# EAGLE design AC_zadnja (EAGLE 7.3.0)
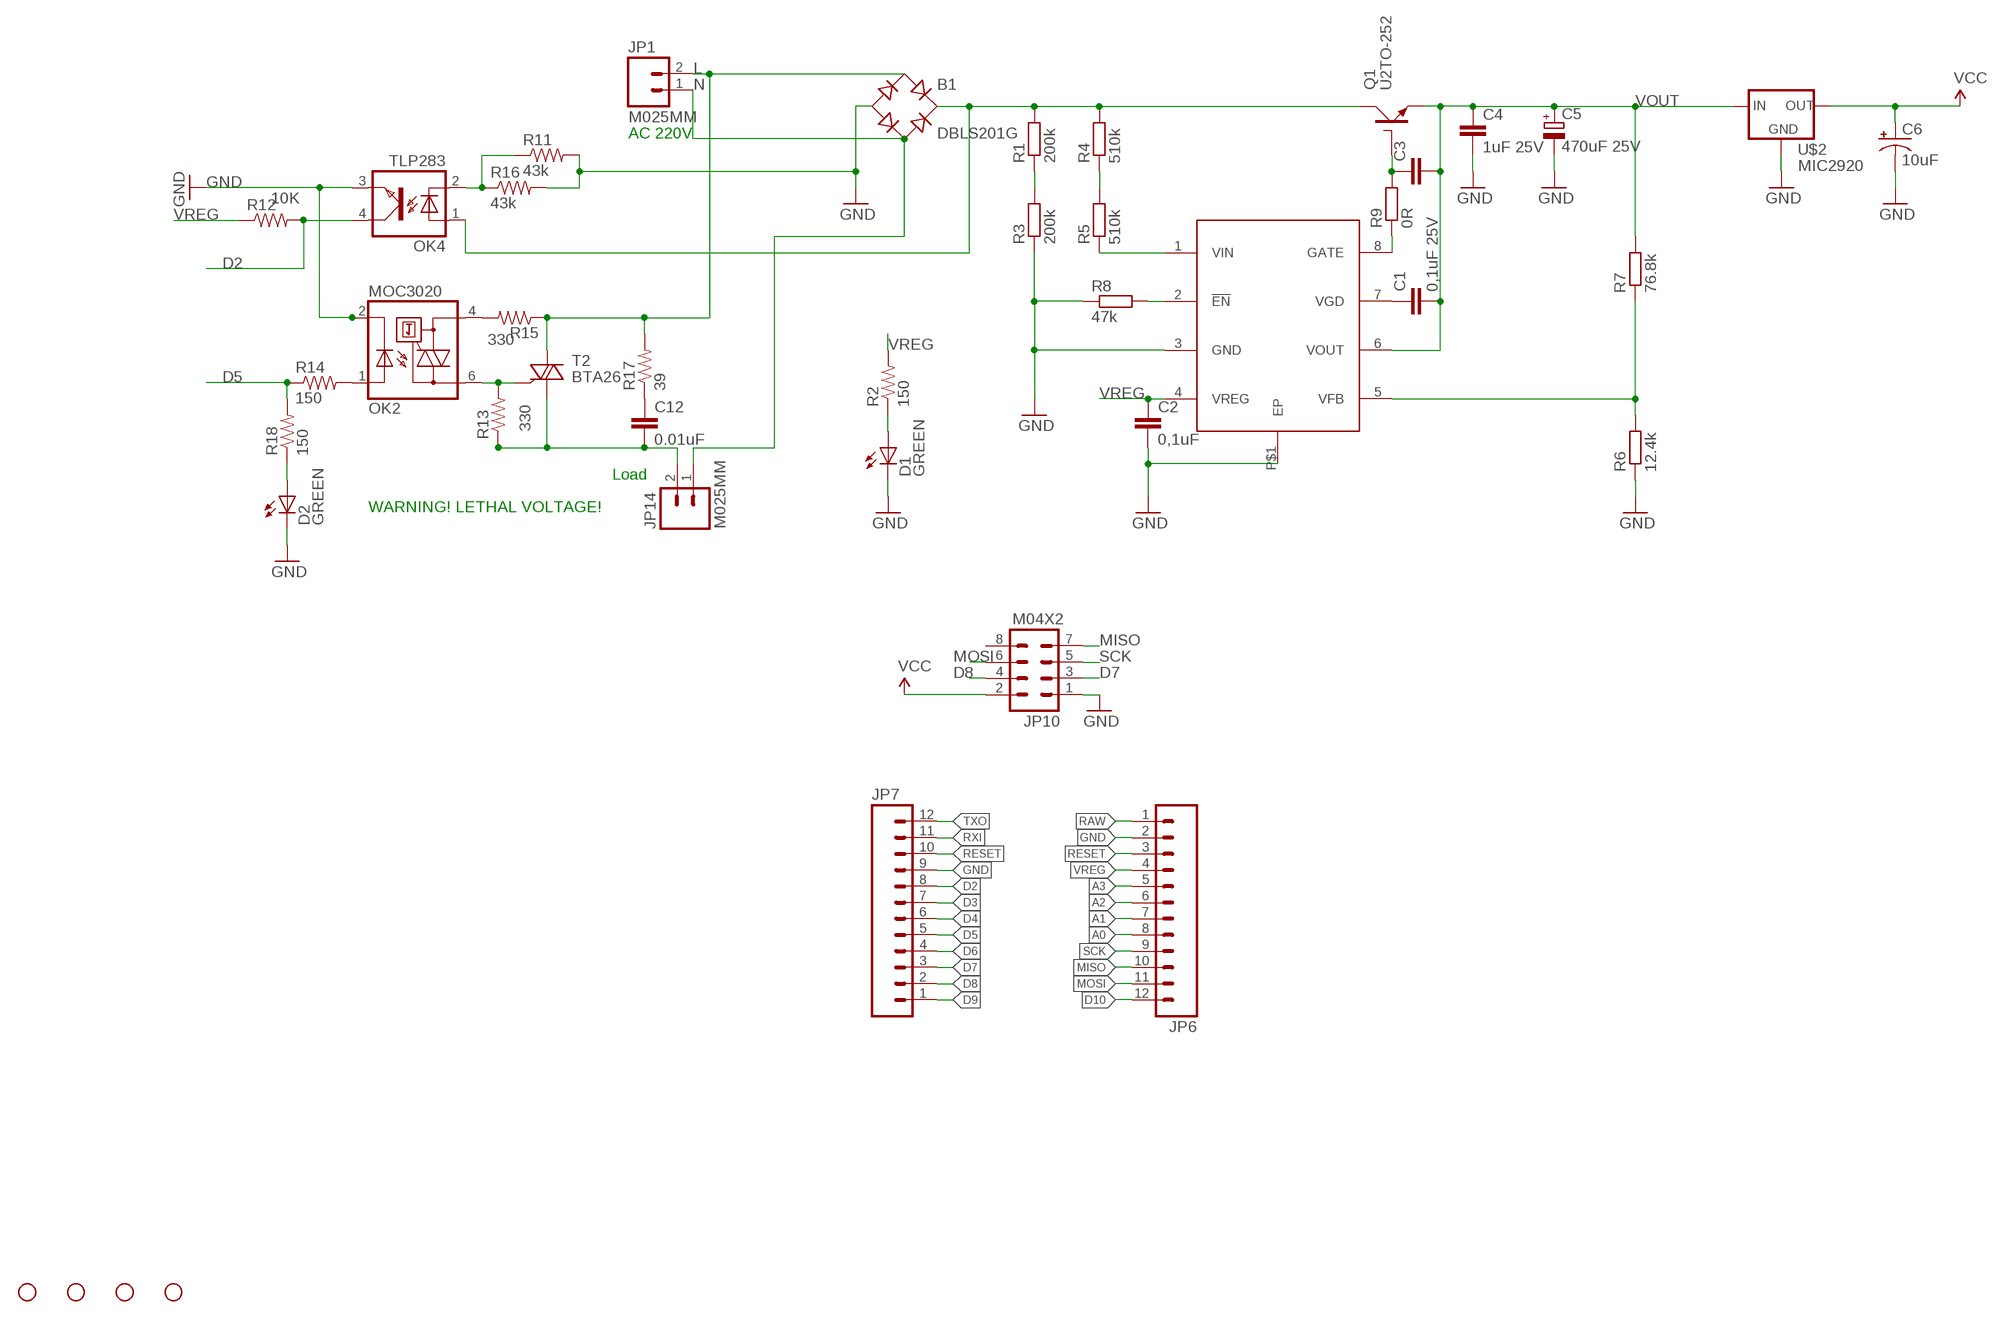
[diagram p0: schematic, sheet 1]

## Parts
B1  DBLS201G  [DBS]
C1  0,1uF 25V  C-EUC0805  [C0805]
C2  0,1uF  C-EUC0805  [C0805]
C3  C-EUC0805  [C0805]
C4  1uF 25V  C-EUC1206  [C1206]
C5  470uF 25V  CPOL-EU153CLV-1010  [153CLV-1010]
C6  10uF  10UF-TANT  [EIA3216]
C12  0.01uF  C-EUC1206  [C1206]
D1  GREEN  LG_T679-E1F1-1  [PLCC2]
D2  GREEN  LG_T679-E1F1-1  [PLCC2]
JP1  M025MM  [SCREWTERMINAL-5MM-2]
JP6  M12PTH  [1X12]
JP7  M12PTH  [1X12]
JP10  M04X2  [2X4]
JP14  M025MM  [SCREWTERMINAL-5MM-2]
OK2  MOC3020  MOC3031S  [DIL6-SMD]
OK4  TLP283  [MINI-FLAT-4]
Q1  U2TO-252  [D-PAK_TO252AA]
R1  200k  R-EU_M1206  [M1206]
R2  150  RESISTOR0805-RES  [0805]
R3  200k  R-EU_M1206  [M1206]
R4  510k  R-EU_M1206  [M1206]
R5  510k  R-EU_M1206  [M1206]
R6  12.4k  R-EU_M0805  [M0805]
R7  76.8k  R-EU_M0805  [M0805]
R8  47k  R-EU_M0805  [M0805]
R9  0R  R-EU_M0805  [M0805]
R11  43k  RESISTOR1206  [1206]
R12  RESISTOR0805-RES  [0805]
R13  RESISTOR1206  [1206]
R14  150  RESISTOR0805-RES  [0805]
R15  RESISTOR1206  [1206]
R16  43k  RESISTOR1206  [1206]
R17  39  RESISTOR1206  [1206]
R18  150  RESISTOR0805-RES  [0805]
STANDOFF1  STAND-OFFTIGHT  [STAND-OFF-TIGHT]
STANDOFF2  STAND-OFFTIGHT  [STAND-OFF-TIGHT]
STANDOFF3  STAND-OFFTIGHT  [STAND-OFF-TIGHT]
STANDOFF4  STAND-OFFTIGHT  [STAND-OFF-TIGHT]
T2  BTA26  BTA26D2PAK  [DPACK_2]
U$1  U1  [SOIC08]
U$2  MIC2920  V_REG_MIC2920  [SOT223]

## Nets
A0: JP6.8
A1: JP6.7
A2: JP6.6
A3: JP6.5
D2: JP7.8 OK4.4(COL) R12.2
D3: JP7.7
D4: JP7.6
D5: JP7.5 R14.1 R18.2
D6: JP7.4
D7: JP7.3 JP10.3
D8: JP7.2 JP10.4
D9: JP7.1
D10: JP6.12
GND: B1.- C2.2 C4.2 C5.- C6.C(-) D1.C D2.C JP6.2 JP7.9 JP10.1 OK2.2(C) OK4.3(EMIT) R3.1 R6.1 R8.1 R11.2 R16.2 U$1.3(GND) U$1.P$1(EP) U$2.2(GND)
L: B1.AC1 JP1.2 R15.1 R17.2 T2.D(A2)
MISO: JP6.10 JP10.7
MOSI: JP6.11 JP10.6
N: B1.AC2 JP1.1 JP14.1
N$1: D1.A R2.1
N$4: R1.1 R3.2
N$5: R4.1 R5.2
N$6: R5.1 U$1.1(VIN)
N$7: C3.1 Q1.1(G) R9.2
N$8: R9.1 U$1.8(GATE)
N$9: R8.2 U$1.2(!EN)
N$11: C1.1 U$1.7(VGD)
N$13: R6.2 R7.1 U$1.5(VFB)
N$15: B1.+ OK4.1(A) Q1.4(C) R1.2 R4.2
N$17: OK4.2(C) R11.1 R16.1
N$28: C12.2 JP14.2 R13.1 T2.G(A1)
N$29: OK2.6(A2) R13.2 T2.S(G)
N$31: OK2.4(A1) R15.2
N$33: OK2.1(A) R14.2
N$37: C12.1 R17.1
N$38: D2.A R18.1
RAW [vcc]: JP6.1
RESET: JP6.3 JP7.10
RXI: JP7.11
SCK: JP6.9 JP10.5
TXO: JP7.12
VCC: C6.A(+) JP10.2 U$2.3(OUT)
VOUT: C1.2 C3.2 C4.1 C5.+ Q1.3(E) R7.2 U$1.6(VOUT) U$2.1(IN)
VREG: C2.1 JP6.4 R2.2 R12.1 U$1.4(VREG)
Unconnected: JP10.8

## Notes on the sheet
- AC 220V
- Load
- WARNING! LETHAL VOLTAGE!

## Library data of the parts
B1 = rectifier:DB?*G: Single Phase 1.0 AMP Glass Passivated Bridge Rectifier Taiwan Semiconductor Co.,Ltd. - TSC Source: http://www.taiwansemi.com/TSCbig5/ezcatfiles/cust/img/img/db101g.pdf http://www.ts.com.tw/db/pictures/modules/PDT/PDT060207001/DBLS201G.pdf
C1-C4 = resistor:C-EU: CAPACITOR, European symbol
C5 = resistor:CPOL-EU: POLARIZED CAPACITOR, European symbol
C6 = SparkFun-Retired:10UF-TANT: 10uF Tantalum SMT CAP-00811- 16V 10% (EIA-3216); PROD_ID: CAP-00811
C12 = rcl:C-EU: CAPACITOR, European symbol
D1 D2 = led:*_T679-?-1: LC TOPLED® Low Current LED Source: http://catalog.osram-os.com .. LG_LS_LY_T679_OBS.pdf; COLOR: green
JP1 JP14 = SparkFun-Connectors:M02: Standard 2-pin 0.1" header. Use with - straight break away headers ( PRT-00116) - right angle break away headers (PRT-00553) - swiss pins (PRT-00743) - machine pins (PRT-00117) - female headers (PRT-00115) Molex polarized connector foot print use with: PRT-08233 with associated crimp pins and housings. 2.54_SCREWTERM for use with PRT-10571. 3.5mm Screw Terminal footprints for PRT-08084 5mm Screw Terminal footprints for use with PRT-08432; STOREFRONT_ID: PRT-08432
JP6 JP7 = SparkFun:M12: Header 12 Standard 12-pin 0.1" header. Use with straight break away headers (SKU : PRT-00116), right angle break away headers (PRT-00553), swiss pins (PRT-00743), machine pins (PRT-00117), and female headers (PRT-00115).
JP10 = SparkFun-Connectors:M04X2: .1" header, two rows of four.
OK2 = optocoupler:MOC30*: 6-Pin DIP Zero-Cross Optoisolators Triac Driver Output (250/400 Volt Peak) Source: Data sheet <http://www.fairchildsemi.com/ds/MO/MOC3031M.pdf> The old path of data sheet not more available 2013-05-06.; MF: FAIRCHILD SEMICONDUCTOR; MPN: MOC3031SM; OC_FARNELL: unknown; OC_NEWARK: 34C1335
OK4 = optocoupler:TLP283: TOSHIBA PHOTOCOUPLER GaAs IRED & PHOTO-TRANSISTOR Source: http://www.semicon.toshiba.co.jp/td/en/Opto/Photocoupler/en_20050928_TLP283_datasheet.pdf; OC_FARNELL: unknown; OC_NEWARK: unknown
Q1 = Moja Knjižnica:U2
R1 R3-R9 = resistor:R-EU_: RESISTOR, European symbol
R2 R13-R15 R18 = SparkFun-Resistors:RESISTOR: Resistor Basic schematic elements and footprints for 0603, 1206, and PTH resistors.; OHM: 330
R11 R16 R17 = SparkFun-Resistors:RESISTOR: Resistor Basic schematic elements and footprints for 0603, 1206, and PTH resistors.; K: 45K
R12 = SparkFun-Resistors:RESISTOR: Resistor Basic schematic elements and footprints for 0603, 1206, and PTH resistors.; OHM: 10K
STANDOFF1-STANDOFF4 = SparkFun-Electromechanical:STAND-OFF: #4 Stand Off This is the mechanical footprint for a #4 phillips button head screw. Use the keepout ring to avoid running the screw head into surrounding components. SKU : PRT-00447
T2 = triac:BTA26: 25A TRIAC Source: http://www.st.com/stonline/products/literature/ds/7470.pdf
U$1 = Moja Knjižnica:U1
U$2 = SparkFun-PowerIC:V_REG_MIC2920: MIC2920A (http://www.micrel.com/_PDF/mic2920.pdf) - 400mA output LDO Regulator

## Net classes
1 vcc: width 0.254 mm

## Board
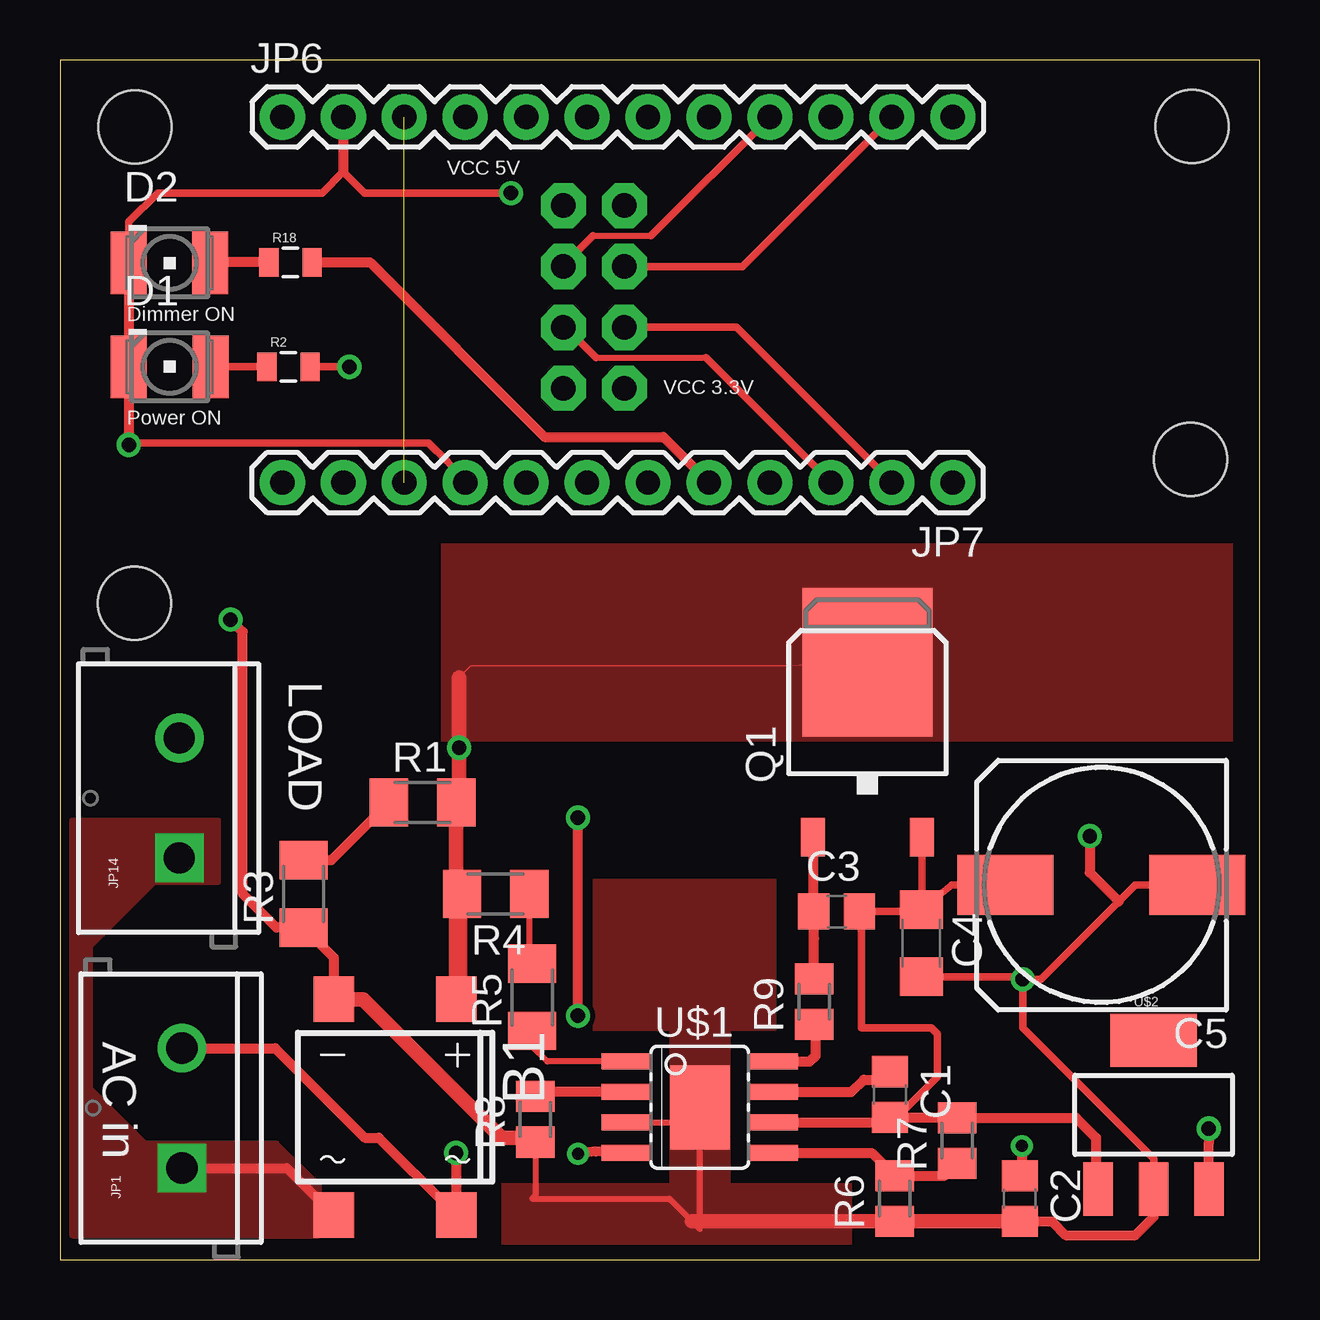
[diagram p1: board, top side]
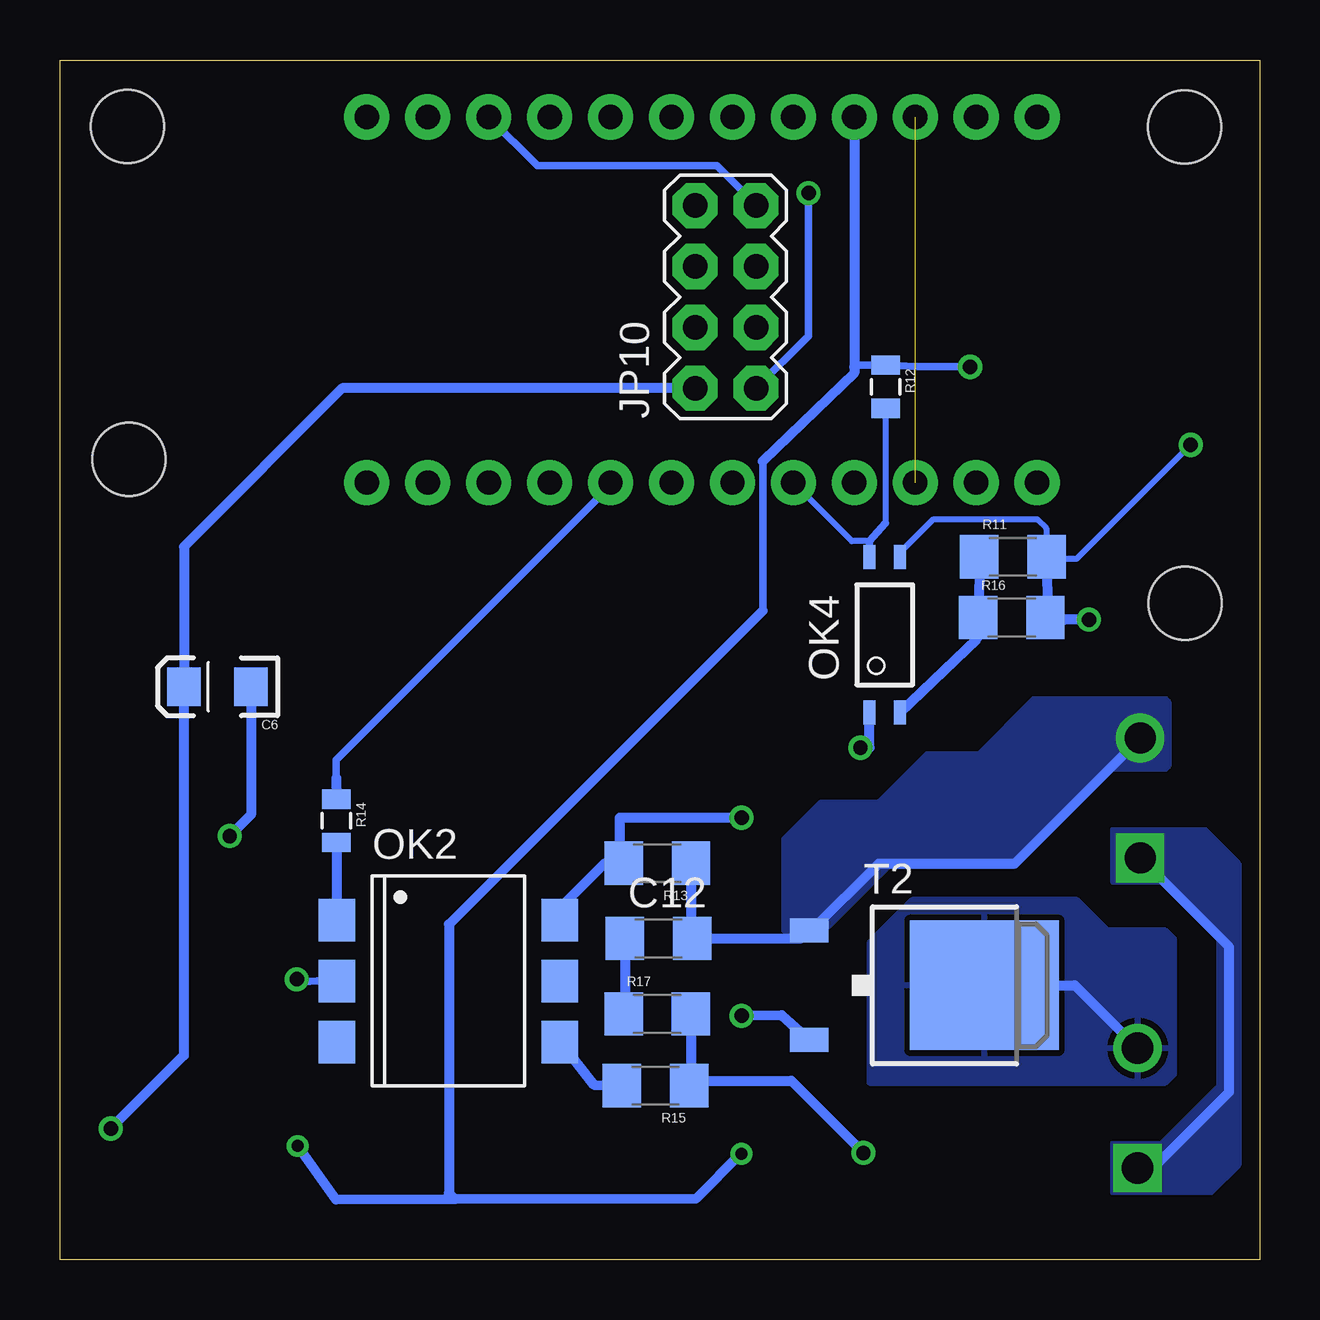
[diagram p2: board, bottom side, seen from below]

Size 50 x 50 mm. Coordinates in mm from the lower left corner, seen from the top.
Outline: 0,0 50,0 50,50 0,50 0,0
Copper layers (1*16): Top 0.035mm / dielectric 1.5mm / Bottom 0.035mm
Design rules "default *": minimum track width 10mil, minimum drill 24mil, track to track 8mil, track to pad 8mil, pad to pad 8mil, via to via 8mil, smd to smd 8mil, copper to edge 10mil, drill to drill 8mil, minimum pad ring 10mil, minimum via ring 8mil, stop-mask expansion 4mil, vias tented up to drill 0mil, thermal gap 10mil

### Footprints (pad centres in the part's own frame; a part is rotated, then mirrored left to right if it is on the bottom)
DBS = smd 1.7 x 1.9: + -2.55,-4.5; - 2.55,-4.5; AC1 -2.55,4.5; AC2 2.55,4.5
C0805 = smd 1.3 x 1.5: 1 -0.95,0; 2 0.95,0
C1206 = smd 1.6 x 1.8: 1 -1.4,0; 2 1.4,0
153CLV-1010 = smd 4 x 2.5: + 4,0; - -4,0
EIA3216 = smd 1.4 x 1.6: A 1.4,0; C -1.4,0
PLCC2 = smd 2.6 x 1.5: A 0,1.7; C 0,-1.7
SCREWTERMINAL-5MM-2 = drill 1.3 pad 2.032 square: 1 0,0 | drill 1.3 pad 2.032: 2 5,0
1X12 = drill 1.016 pad 1.88: 1 0,0; 2 2.54,0; 3 5.08,0; 4 7.62,0; 5 10.16,0; 6 12.7,0; 7 15.24,0; 8 17.78,0; 9 20.32,0; 10 22.86,0; 11 25.4,0; 12 27.94,0
2X4 = drill 1.016 pad 1.88 octagon: 1 -3.81,-1.27; 2 -3.81,1.27; 3 -1.27,-1.27; 4 -1.27,1.27; 5 1.27,-1.27; 6 1.27,1.27; 7 3.81,-1.27; 8 3.81,1.27
DIL6-SMD = smd 1.78 x 1.52: 1 -2.54,-4.645; 2 0,-4.645; 3 2.54,-4.645; 4 2.54,4.645; 5 0,4.645; 6 -2.54,4.645
MINI-FLAT-4 = smd 1 x 0.5: 1 -3.24,0.635; 2 -3.24,-0.635; 3 3.24,-0.635; 4 3.24,0.635
D-PAK_TO252AA = smd 1 x 1.6: 1 -2.28,-4.8; 3 2.28,-4.8 | smd 5.4 x 6.2: 4 0,2.5
M1206 = smd 1.6 x 2: 1 -1.4,0; 2 1.4,0
0805 = smd 0.8 x 1.2: 1 -0.9,0; 2 0.9,0
M0805 = smd 1.3 x 1.6: 1 -0.95,0; 2 0.95,0
1206 = smd 1.6 x 1.8: 1 -1.4,0; 2 1.4,0
STAND-OFF-TIGHT = hole 3.048: 0,0
DPACK_2 = smd 5.4 x 6.2: D 0,2.5 | smd 1 x 1.6: G -2.28,-4.8; S 2.28,-4.8
SOIC08 = smd 0.66 x 2.032: 1 -1.905,-3.073; 2 -0.635,-3.073; 3 0.635,-3.073; 4 1.905,-3.073; 5 1.905,3.073; 6 0.635,3.073; 7 -0.635,3.073; 8 -1.905,3.073 | smd 3.5 x 2.5: P$1 0,0
SOT223 = smd 1.219 x 2.235: 1 -2.311,-3.099; 2 0,-3.099; 3 2.311,-3.099 | smd 3.6 x 2.2: 4 0,3.099

### Placement (x,y rotation side)
B1  13.97,6.35 180 top
C1  34.59,6.88 270 top
C2  40.01,2.54 270 top
C3  32.37,14.5 0 top
C4  35.9,13.19 270 top
C5  43.41,15.61 180 top
C6  43.43,23.88 180 bottom
C12  25.05,13.39 0 bottom
D1  4.57,37.21 270 top
D2  4.57,41.54 270 top
JP1  5.08,3.81 90 top
JP6  9.27,47.62 0 top
JP7  37.21,32.38 180 top
JP10  22.26,40.12 90 bottom
JP14  4.97,16.73 90 top
OK2  33.81,11.61 270 bottom
OK4  15.62,26.04 90 bottom
Q1  33.66,22.4 0 top
R1  15.11,19.05 0 top
R2  9.53,37.21 0 top
R3  10.16,15.24 90 top
R4  18.16,15.24 180 top
R5  19.68,10.93 90 top
R6  34.79,2.54 90 top
R7  37.4,4.96 90 top
R8  19.82,5.85 90 top
R9  31.43,10.75 90 top
R11  10.28,29.3 0 bottom
R12  15.59,36.38 270 bottom
R13  25.1,16.52 180 bottom
R14  38.48,18.28 270 bottom
R15  25.18,7.25 180 bottom
R16  10.33,26.75 0 bottom
R17  25.11,10.24 0 bottom
R18  9.61,41.56 0 top
STANDOFF1  47.12,33.36 90 top
STANDOFF2  3.13,47.2 90 top
STANDOFF3  3.1,27.36 90 top
STANDOFF4  47.19,47.23 90 top
T2  13.97,11.43 270 bottom
U$1  26.67,6.35 270 top
U$2  45.59,6.04 0 top

### Tracks (layer width: path | path; a pad name or v marks a point on that pad's centre or on a via)
D2
  Bottom 0.254: R12.2 15.59,30.71 | 16.26,29.95 16.99,29.95 JP7.8
  Bottom 0.305: 15.59,30.71 16.26,29.95 OK4.4
D5
  Top 0.406: R18.2 12.92,41.56 20.19,34.29 25.15,34.29 JP7.5
  Bottom 0.305: JP7.5 27.05,32.26 38.48,20.83 38.48,20.07
  Bottom 0.406: 38.48,20.07 R14.1
D7
  Top 0.254: 22.35,37.59 26.92,37.59
  Top 0.305: JP10.3 21.09,38.85 22.35,37.59 | 26.92,37.59 JP7.3
D8
  Top 0.305: JP10.4 28.2,38.85 JP7.2
GND  (via drill 0.6)
  Top 0.254: R8.1 19.82,2.67 19.68,2.54 25.4,2.54 26.35,1.59 26.67,1.27 26.67,5.71 U$1.3
  Top 0.305: D1.C 2.87,37.59 | C5.- 44.81,15.61 44.13,14.92 40.89,11.68 v40.13,11.68 | C4.2 40.03,11.79 v40.13,11.68 | U$2.2 45.59,4.2 40.13,9.65 v40.13,11.68 | JP7.9 16.13,33.27 15.37,34.04 2.95,34.04 v2.87,33.96 | D2.C 2.87,43.26 4.06,44.45 10.92,44.45 11.81,45.34 12.7,44.45 v18.8,44.45
  Top 0.406: B1.- 11.42,12.58 R3.1 9.02,13.84 7.62,15.24 7.62,26.16 v7.11,26.67 | 45.72,2.8 U$2.2 45.59,2.93 45.59,1.78 44.83,1.02 41.91,1.02 41.34,1.59 C2.2 | D2.C 2.87,37.59 v2.87,33.96 | JP6.2 11.81,45.34 | v42.93,17.65 42.93,16.13 44.13,14.92
  Top 0.61: B1.- 12.64,10.85 18.41,5.08 19.64,5.08 R8.1 | C2.2 R6.1 26.36,1.59 26.35,1.59
  Bottom 0.254: OK4.3 14.99,29.46 13.59,30.86 9.27,30.86 8.89,30.48 R11.2 | 8.76,26.87 8.76,29.21 7.62,29.21 v2.87,33.96
  Bottom 0.305: v40.13,11.68 40.13,11.56 39.29,11.61 OK2.2 | 8.76,26.87 R11.2 | v18.8,44.45 18.8,38.85 18.8,38.5 JP10.1
  Bottom 0.406: v7.11,26.67 8.13,26.67 8.76,26.66 8.64,26.66 R16.2 8.8,27.31 R11.2 | C6.C 42.03,18.55 v42.93,17.65
  pour Top (no thermals): 25.4,5.08 25.4,3.17 18.41,3.17 18.41,0.64 33.02,0.64 33.02,3.17 27.94,3.17 27.94,5.08
  pour Top (no thermals): 25.4,7.62 25.4,9.53 22.23,9.53 22.23,15.88 29.84,15.88 29.84,9.53 27.94,9.53 27.94,7.62
L  (via drill 0.6)
  Top 0.406: JP1.2 8.97,8.81 12.7,5.08 13.29,5.08 16.17,2.2 | 16.17,2.2 B1.AC1 | v16.51,4.45 16.51,2.54 16.17,2.2
  Bottom 0.406: R17.2 23.71,7.45 | 23.71,7.45 R15.1 | T2.D 7.7,11.43 JP1.2 | 23.71,7.45 19.52,7.45 v16.51,4.45
  pour Bottom: 3.94,13.72 6.35,13.72 7.62,14.99 14.48,14.99 16.26,13.21 16.26,7.37 3.94,7.37 3.56,7.75 3.56,13.34
MISO
  Bottom 0.305: JP10.7 20.99,43.97 22.61,45.59 30.1,45.59 JP6.10
MOSI
  Top 0.305: JP10.6 28.44,41.4 JP6.11
N
  Top 0.406: JP1.1 9.46,3.81 B1.AC2
  Bottom 0.406: JP1.1 4.45,3.81 1.27,6.99 1.27,13.03 JP14.1
  pour Top (no thermals): 6.6,18.29 0.51,18.29 0.51,1.02 10.79,1.02 10.79,3.05 9.02,4.83 3.56,4.83 1.27,7.11 1.27,13.08 3.94,15.75 6.6,15.75
  pour Bottom (no thermals): 4.7,17.91 2.29,17.91 1.14,16.76 0.89,16.51 0.89,3.94 2.03,2.79 6.1,2.79 6.1,4.83 4.06,4.83 1.65,7.24 1.65,13.46 3.94,15.75 6.1,15.75 6.1,17.91
N$1
  Top 0.305: R2.1 D1.A
N$4
  Top 0.406: R1.1 11.31,16.64 R3.2
N$5
  Top 0.254: R4.1 19.56,12.45 R5.2
N$6
  Top 0.254: U$1.1 20.32,8.26 19.68,8.89 R5.1
N$7
  Top 0.406: R9.2 31.43,13.37 C3.1 31.51,14.63 31.41,14.22 31.41,17.18 Q1.1
N$8
  Top 0.406: U$1.8 31.25,8.26 31.5,8.5 31.5,9.73 R9.1
N$9
  Top 0.406: U$1.2 20,6.99 R8.2
N$11
  Top 0.406: U$1.7 32.98,6.99 33.5,7.5 34.26,7.5 C1.1
N$13
  Top 0.406: U$1.5 33.84,4.45 R6.2 36.88,3.49 R7.1
N$15  (via drill 0.6)
  Top 0: 16.64,24.26 17.14,24.77 30.34,24.77 Q1.4
  Top 0.406: R4.2 16.76,11.24 B1.+ | 16.64,19.55 v16.64,21.34
  Top 0.61: B1.+ 16.52,15.37 R1.2 16.64,19.55 16.64,24.26
  Bottom 0.406: v16.64,21.34 16.26,21.34 OK4.1
  pour Top (no thermals): 48.9,21.59 15.88,21.59 15.88,29.84 48.9,29.84
N$17
  Bottom 0.406: R11.1 11.68,28.61 R16.1 11.79,25.87 OK4.2
N$28
  Bottom 0.406: R13.1 23.7,13.31 C12.2 19.09,13.39 T2.G 18.68,13.71 15.88,16.51 10.2,16.51 JP14.2
  pour Bottom (no thermals): 3.94,20.45 6.22,20.45 10.29,16.38 15.49,16.38 18.29,13.59 19.68,13.59 19.81,13.72 19.81,17.53 18.29,19.05 15.88,19.05 13.84,21.08 11.68,21.08 9.4,23.37 3.94,23.37 3.81,23.24 3.81,20.57
N$29  (via drill 0.6)
  Top 0.406: v21.59,10.16 v21.59,18.41
  Bottom 0.406: OK2.6 29.16,14.65 27.3,16.51 26.76,16.51 R13.2 26.67,16.98 26.67,18.41 v21.59,18.41 | T2.S 19.91,10.19 v21.59,10.16
N$31
  Bottom 0.406: OK2.4 27.76,7.29 R15.2
N$33
  Bottom 0.406: R14.2 38.48,14.12 OK2.1
N$37
  Bottom 0.406: C12.1 26.45,10.81 R17.1
N$38
  Top 0.406: R18.1 6.8,41.56 D2.A
RESET  (1 unrouted)
SCK
  Top 0.254: 22.23,42.67 24.64,42.67
  Top 0.305: JP10.5 20.99,41.43 22.23,42.67 | 24.64,42.67 JP6.9
VCC  (via drill 0.6)
  Top 0.406: v47.88,5.46 47.88,4.83 47.9,2.9 U$2.3
  Bottom 0.406: JP10.2 38.23,36.31 44.83,29.72 C6.A 44.83,8.51 v47.88,5.46
VOUT
  Top 0.305: Q1.3 35.94,14.62 C4.1 | C5.+ 37.17,15.61 C4.1 | C4.1 35.94,14.5 C3.2 33.4,14.29 33.4,9.65 36.32,9.65 36.58,9.4 36.58,7.62 34.89,5.93 C1.2
  Top 0.406: U$1.6 34.38,5.71 C1.2 34.61,5.91 R7.2 42.35,5.91 43.18,5.08 43.18,3.03 U$2.1
VREG  (via drill 0.5, 0.6)
  Top 0.305: R2.2 v12.06,37.21
  Top 0.406: U$1.4 22.33,4.5 v21.59,4.41 | v40.09,4.73 40.09,3.58 C2.1
  Bottom 0.305: 20.7,33.27 20.7,27.05 | v12.06,37.21 14.25,37.21 R12.1 16.82,37.28 16.89,37.21
  Bottom 0.406: v21.59,4.41 21.63,4.41 23.5,2.54 33.53,2.51 | 33.53,2.51 38.5,2.5 v40.09,4.73 | JP6.4 16.89,37.21 16.89,36.96 20.7,33.27 | 20.7,27.05 33.78,13.97 33.78,2.77 33.53,2.51

### Text on the board
tPlace: VCC 5V | Dimmer ON | VCC 3.3V | Power ON | LOAD | AC in